# EAGLE design MotorController (EAGLE 6.1)
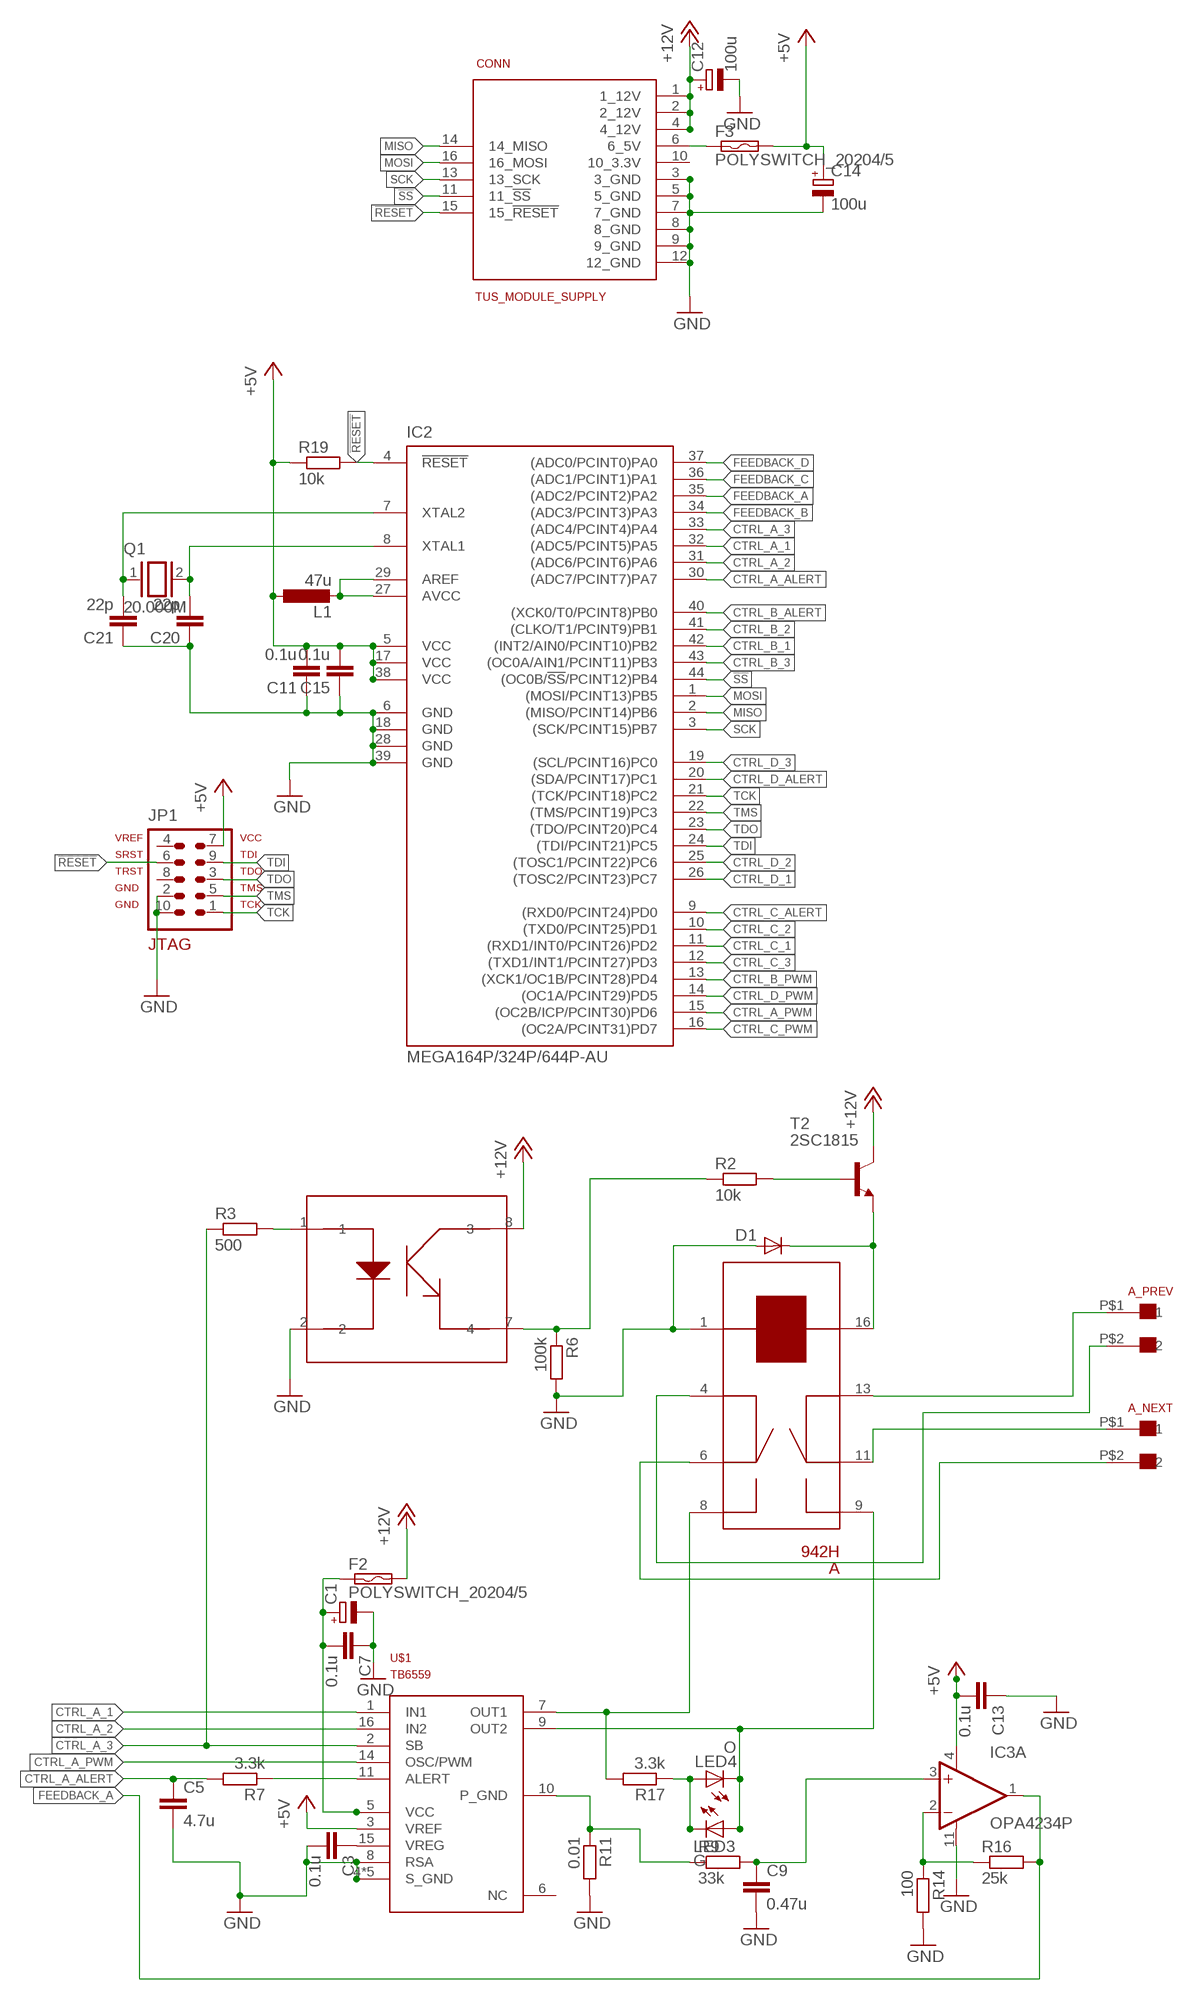
[diagram p0: schematic, sheet 1, part 1 of 2]
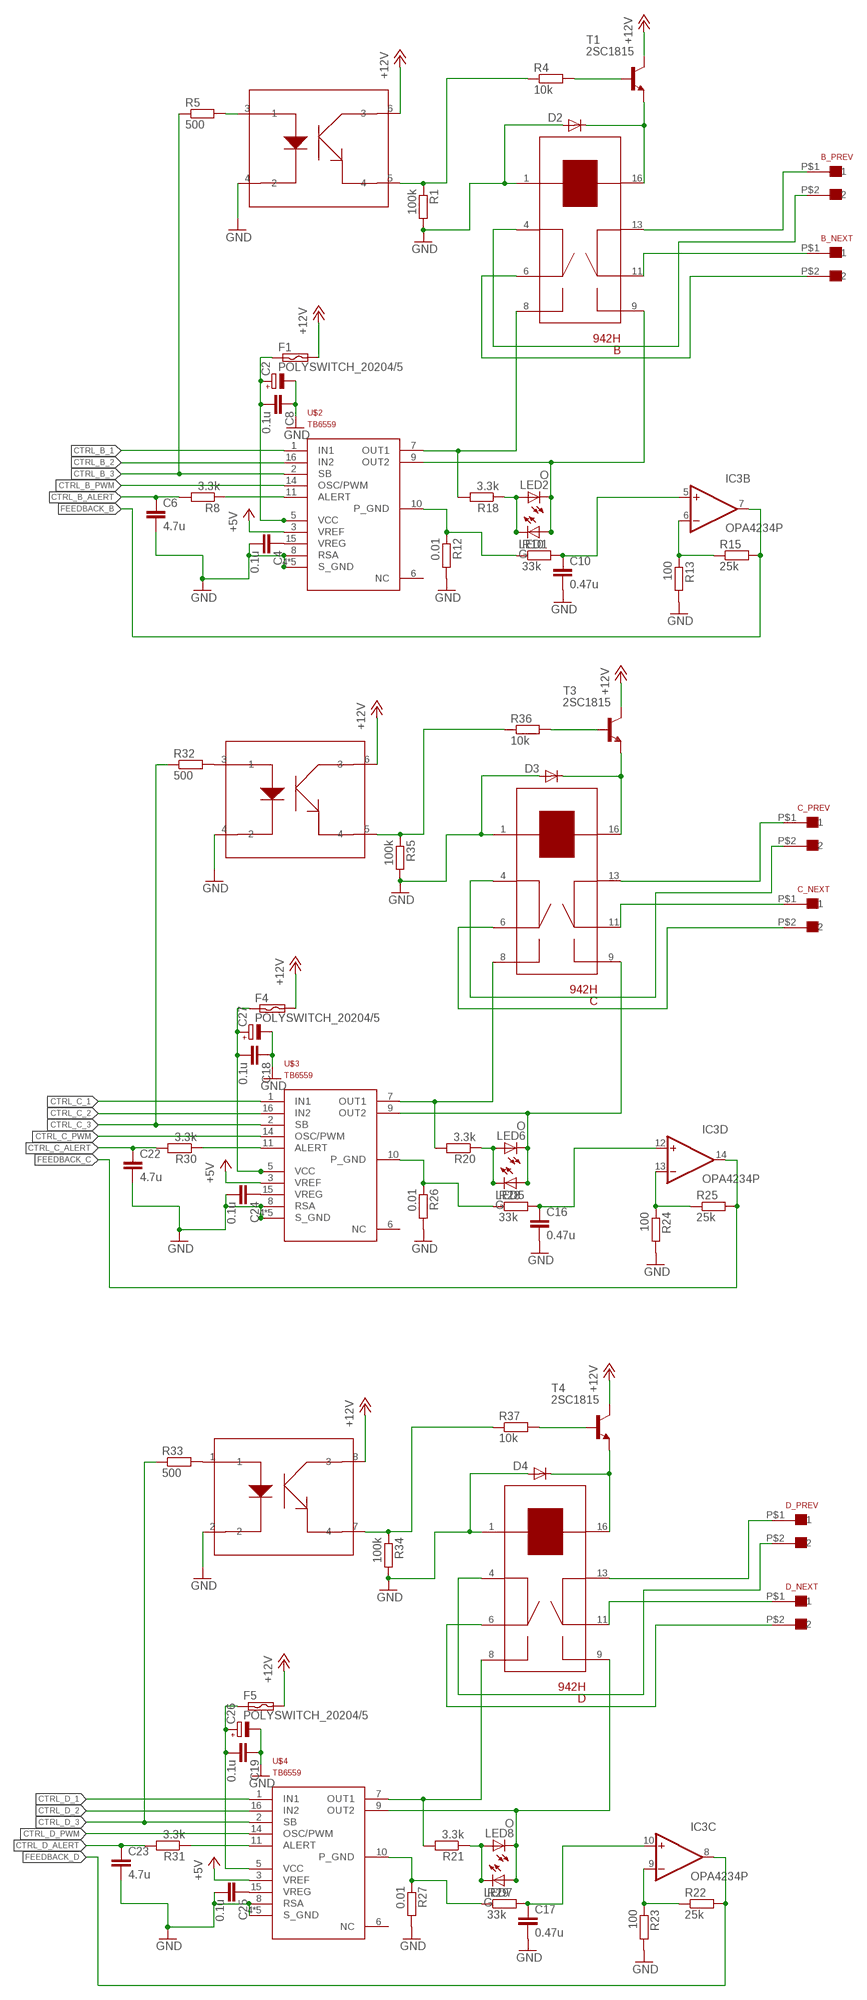
[diagram p1: schematic, sheet 1, part 2 of 2]

## Parts
A  942H  [941H-2C-12D]
A_NEXT  XH-2  [XH-2]
A_PREV  XH-2  [XH-2]
B  942H  [941H-2C-12D]
B_NEXT  XH-2  [XH-2]
B_PREV  XH-2  [XH-2]
C  942H  [941H-2C-12D]
C1  CPOL-EUE2,5-6E  [E2,5-6E]
C2  CPOL-EUE2,5-6E  [E2,5-6E]
C3  0.1u  C-EUC0603  [C0603]
C4  0.1u  C-EUC0603  [C0603]
C5  4.7u  C-EUC0603  [C0603]
C6  4.7u  C-EUC0603  [C0603]
C7  0.1u  C-EUC0603  [C0603]
C8  0.1u  C-EUC0603  [C0603]
C9  0.47u  C-EUC0603  [C0603]
C10  0.47u  C-EUC0603  [C0603]
C11  0.1u  C-EUC0603  [C0603]
C12  100u  CPOL-EUE2.5-6  [E2,5-6]
C13  0.1u  C-EUC0603  [C0603]
C14  100u  CPOL-EUE2-5  [E2-5]
C15  0.1u  C-EUC0603  [C0603]
C16  0.47u  C-EUC0603  [C0603]
C17  0.47u  C-EUC0603  [C0603]
C18  0.1u  C-EUC0603  [C0603]
C19  0.1u  C-EUC0603  [C0603]
C20  22p  C-EUC0603  [C0603]
C21  22p  C-EUC0603  [C0603]
C22  4.7u  C-EUC0603  [C0603]
C23  4.7u  C-EUC0603  [C0603]
C24  0.1u  C-EUC0603  [C0603]
C25  0.1u  C-EUC0603  [C0603]
C26  CPOL-EUE2,5-6E  [E2,5-6E]
C27  CPOL-EUE2,5-6E  [E2,5-6E]
C_NEXT  XH-2  [XH-2]
C_PREV  XH-2  [XH-2]
CONN  TUS_MODULE_SUPPLY  [2X08]
D  942H  [941H-2C-12D]
D1  1N4148DO35-7  [DO35-7]
D2  1N4148DO35-7  [DO35-7]
D3  1N4148DO35-7  [DO35-7]
D4  1N4148DO35-7  [DO35-7]
D_NEXT  XH-2  [XH-2]
D_PREV  XH-2  [XH-2]
F1  POLYSWITCH_20204/5  [0204/5]
F2  POLYSWITCH_20204/5  [0204/5]
F3  POLYSWITCH_20204/5  [0204/5]
F4  POLYSWITCH_20204/5  [0204/5]
F5  POLYSWITCH_20204/5  [0204/5]
IC1  TLP621-2  [SOCKET-08]
IC2  MEGA164P/324P/644P-AU  [TQFP44]
IC3  OPA4234P  [DIL14]
IC4  TLP621-2  [SOCKET-08]
JP1  AVR-JTAG-10  [AVR-JTAG-10]
L1  47u  L-EUL3216C  [L3216C]
LED1  G  LED3MM  [LED3MM]
LED2  O  LED3MM  [LED3MM]
LED3  G  LED3MM  [LED3MM]
LED4  O  LED3MM  [LED3MM]
LED5  G  LED3MM  [LED3MM]
LED6  O  LED3MM  [LED3MM]
LED7  G  LED3MM  [LED3MM]
LED8  O  LED3MM  [LED3MM]
Q1  20.000M  XTAL/S  [QS]
R1  100k  R-EU_R0603  [R0603]
R2  10k  R-EU_R0603  [R0603]
R3  500  R-EU_R0603  [R0603]
R4  10k  R-EU_R0603  [R0603]
R5  500  R-EU_R0603  [R0603]
R6  100k  R-EU_R0603  [R0603]
R7  3.3k  R-EU_R0603  [R0603]
R8  3.3k  R-EU_R0603  [R0603]
R9  33k  R-EU_R0603  [R0603]
R10  33k  R-EU_R0603  [R0603]
R11  0.01  R-EU_R1206  [R1206]
R12  0.01  R-EU_R1206  [R1206]
R13  100  R-EU_R0603  [R0603]
R14  100  R-EU_R0603  [R0603]
R15  25k  R-EU_R0603  [R0603]
R16  25k  R-EU_R0603  [R0603]
R17  3.3k  R-EU_R0603  [R0603]
R18  3.3k  R-EU_R0603  [R0603]
R19  10k  R-EU_R0603  [R0603]
R20  3.3k  R-EU_R0603  [R0603]
R21  3.3k  R-EU_R0603  [R0603]
R22  25k  R-EU_R0603  [R0603]
R23  100  R-EU_R0603  [R0603]
R24  100  R-EU_R0603  [R0603]
R25  25k  R-EU_R0603  [R0603]
R26  0.01  R-EU_R1206  [R1206]
R27  0.01  R-EU_R1206  [R1206]
R28  33k  R-EU_R0603  [R0603]
R29  33k  R-EU_R0603  [R0603]
R30  3.3k  R-EU_R0603  [R0603]
R31  3.3k  R-EU_R0603  [R0603]
R32  500  R-EU_R0603  [R0603]
R33  500  R-EU_R0603  [R0603]
R34  100k  R-EU_R0603  [R0603]
R35  100k  R-EU_R0603  [R0603]
R36  10k  R-EU_R0603  [R0603]
R37  10k  R-EU_R0603  [R0603]
T1  2SC1815  [TO92-ECB]
T2  2SC1815  [TO92-ECB]
T3  2SC1815  [TO92-ECB]
T4  2SC1815  [TO92-ECB]
U$1  TB6559  [HSOP-16]
U$2  TB6559  [HSOP-16]
U$3  TB6559  [HSOP-16]
U$4  TB6559  [HSOP-16]

## Nets
!RESET: CONN.15(15_!RESET) IC2.4(!RESET) JP1.6 R19.2
!SS: CONN.11(11_!SS) IC2.44((OC0B/!SS!/PCINT12)PB4)
+5V [5v]: C11.2 C13.2 C14.+ C15.2 F3.2 IC2.5(VCC) IC2.17(VCC) IC2.38(VCC) IC3.4(A:V+) JP1.7 L1.1 R19.1 U$1.3(VREF) U$2.3(VREF) U$3.3(VREF) U$4.3(VREF)
+12V [12v]: C12.+ CONN.1(1_12V) CONN.2(2_12V) CONN.4(4_12V) F1.2 F2.2 F4.2 F5.2 IC1.6 IC1.8 IC4.6 IC4.8 T1.C T2.C T3.C T4.C
A_OUT1 [12v_sup]: A.8 R17.2 U$1.7(OUT1)
A_OUT2 [12v_sup]: A.9('1) LED3.A LED4.K(C) U$1.9(OUT2)
A_OUT3 [12v_sup]: C.8 R20.2 U$3.7(OUT1)
A_OUT4 [12v_sup]: C.9('1) LED5.A LED6.K(C) U$3.9(OUT2)
A_OUT5 [12v_sup]: B.8 R18.2 U$2.7(OUT1)
A_OUT6 [12v_sup]: B.9('1) LED1.A LED2.K(C) U$2.9(OUT2)
A_OUT7 [12v_sup]: D.8 R21.2 U$4.7(OUT1)
A_OUT8 [12v_sup]: D.9('1) LED7.A LED8.K(C) U$4.9(OUT2)
CTRL_A_1: IC2.32((ADC5/PCINT5)PA5) U$1.1(IN1)
CTRL_A_2: IC2.31((ADC6/PCINT6)PA6) U$1.16(IN2)
CTRL_A_3: IC2.33((ADC4/PCINT4)PA4) R3.1 U$1.2(SB)
CTRL_A_ALERT: C5.1 IC2.30((ADC7/PCINT7)PA7) R7.2
CTRL_A_PWM: IC2.15((OC2B/ICP/PCINT30)PD6) U$1.14(OSC/PWM)
CTRL_B_1: IC2.42((INT2/AIN0/PCINT10)PB2) U$2.1(IN1)
CTRL_B_2: IC2.41((CLKO/T1/PCINT9)PB1) U$2.16(IN2)
CTRL_B_3: IC2.43((OC0A/AIN1/PCINT11)PB3) R5.1 U$2.2(SB)
CTRL_B_ALERT: C6.1 IC2.40((XCK0/T0/PCINT8)PB0) R8.2
CTRL_B_PWM: IC2.13((XCK1/OC1B/PCINT28)PD4) U$2.14(OSC/PWM)
CTRL_C_1: IC2.11((RXD1/INT0/PCINT26)PD2) U$3.1(IN1)
CTRL_C_2: IC2.10((TXD0/PCINT25)PD1) U$3.16(IN2)
CTRL_C_3: IC2.12((TXD1/INT1/PCINT27)PD3) R32.1 U$3.2(SB)
CTRL_C_ALERT: C22.1 IC2.9((RXD0/PCINT24)PD0) R30.2
CTRL_C_PWM: IC2.16((OC2A/PCINT31)PD7) U$3.14(OSC/PWM)
CTRL_D_1: IC2.26((TOSC2/PCINT23)PC7) U$4.1(IN1)
CTRL_D_2: IC2.25((TOSC1/PCINT22)PC6) U$4.16(IN2)
CTRL_D_3: IC2.19((SCL/PCINT16)PC0) R33.1 U$4.2(SB)
CTRL_D_ALERT: C23.1 IC2.20((SDA/PCINT17)PC1) R31.2
CTRL_D_PWM: IC2.14((OC1A/PCINT29)PD5) U$4.14(OSC/PWM)
D [12v_sup]: D.4 D_PREV.P$2
FEEDBACK_A: IC2.35((ADC2/PCINT2)PA2) IC3.1(A:OUT) R16.2
FEEDBACK_B: IC2.34((ADC3/PCINT3)PA3) IC3.7(B:OUT) R15.2
FEEDBACK_C: IC2.36((ADC1/PCINT1)PA1) IC3.14(D:OUT) R25.2
FEEDBACK_D: IC2.37((ADC0/PCINT0)PA0) IC3.8(C:OUT) R22.2
GND: A.1 B.1 C1.- C2.- C3.2 C4.2 C5.2 C6.2 C7.1 C8.1 C9.2 C10.2 C11.1 C12.- C13.1 C14.- C15.1 C16.2 C17.2 C18.1 C19.1 C20.1 C21.1 C22.2 C23.2 C24.2 C25.2 C26.- C27.- C.1 CONN.3(3_GND) CONN.5(5_GND) CONN.7(7_GND) CONN.8(8_GND) CONN.9(9_GND) CONN.12(12_GND) D1.A D2.A D3.A D4.A D.1 IC1.2 IC1.4 IC2.6(GND) IC2.18(GND) IC2.28(GND) IC2.39(GND) IC3.11(A:V-) IC4.2 IC4.4 JP1.2 JP1.10 R1.2 R6.2 R11.2 R12.2 R13.2 R14.2 R23.2 R24.2 R26.2 R27.2 R34.2 R35.2 U$1.4(S_GND) U$1.8(RSA) U$1.12(S_GND) U$1.13(S_GND) U$1.FIN_1(S_GND) U$1.FIN_2(S_GND) U$2.4(S_GND) U$2.8(RSA) U$2.12(S_GND) U$2.13(S_GND) U$2.FIN_1(S_GND) U$2.FIN_2(S_GND) U$3.4(S_GND) U$3.8(RSA) U$3.12(S_GND) U$3.13(S_GND) U$3.FIN_1(S_GND) U$3.FIN_2(S_GND) U$4.4(S_GND) U$4.8(RSA) U$4.12(S_GND) U$4.13(S_GND) U$4.FIN_1(S_GND) U$4.FIN_2(S_GND)
MISO: CONN.14(14_MISO) IC2.2((MISO/PCINT14)PB6)
MOSI: CONN.16(16_MOSI) IC2.1((MOSI/PCINT13)PB5)
N$1: IC2.27(AVCC) IC2.29(AREF) L1.2
N$2: C21.2 IC2.7(XTAL2) Q1.1
N$3: C20.2 IC2.8(XTAL1) Q1.2
N$4: R7.1 U$1.11(ALERT)
N$5: C3.1 U$1.15(VREG)
N$6: IC1.1 R3.2
N$7: IC1.7 R2.1 R6.1
N$8: LED3.K(C) LED4.A R17.1
N$9: C24.1 U$3.15(VREG)
N$10 [12v_sup]: C1.+ C7.2 F2.1 U$1.5(VCC)
N$11: IC3.2(A:-IN) R14.1 R16.1
N$12: R30.1 U$3.11(ALERT)
N$13 [12v_sup]: A.6 A_NEXT.P$2
N$14: R9.1 R11.1 U$1.10(P_GND)
N$15 [12v_sup]: A.11('2) A_NEXT.P$1
N$16 [12v_sup]: A.4 A_PREV.P$2
N$17 [12v_sup]: A.13('3) A_PREV.P$1
N$18 [12v_sup]: C18.2 C27.+ F4.1 U$3.5(VCC)
N$19: LED5.K(C) LED6.A R20.1
N$20: IC1.3 R5.2
N$21: C9.1 IC3.3(A:+IN) R9.2
N$22 [12v_sup]: C.6 C_NEXT.P$2
N$23 [12v_sup]: C.11('2) C_NEXT.P$1
N$24 [12v_sup]: C.4 C_PREV.P$2
N$25 [12v_sup]: C.13('3) C_PREV.P$1
N$26: IC4.5 R35.1 R36.1
N$27 [12v]: C.16('4) D3.C T3.E
N$28: R36.2 T3.B
N$29: IC3.13(D:-IN) R24.1 R25.1
N$30: C16.1 IC3.12(D:+IN) R28.2
N$31: R26.1 R28.1 U$3.10(P_GND)
N$32: C4.1 U$2.15(VREG)
N$33: R8.1 U$2.11(ALERT)
N$34 [12v_sup]: C2.+ C8.2 F1.1 U$2.5(VCC)
N$35: LED1.K(C) LED2.A R18.1
N$36: IC4.1 R33.2
N$37 [12v_sup]: B.6 B_NEXT.P$2
N$38 [12v_sup]: B.11('2) B_NEXT.P$1
N$39 [12v_sup]: B.4 B_PREV.P$2
N$40 [12v_sup]: B.13('3) B_PREV.P$1
N$41: IC1.5 R1.1 R4.1
N$42 [12v]: B.16('4) D2.C T1.E
N$43: R4.2 T1.B
N$44: IC3.6(B:-IN) R13.1 R15.1
N$45: C10.1 IC3.5(B:+IN) R10.2
N$46: R10.1 R12.1 U$2.10(P_GND)
N$47: C25.1 U$4.15(VREG)
N$48: R31.1 U$4.11(ALERT)
N$49 [12v_sup]: C19.2 C26.+ F5.1 U$4.5(VCC)
N$50: LED7.K(C) LED8.A R21.1
N$51: IC4.3 R32.2
N$52 [12v_sup]: D.6 D_NEXT.P$2
N$53 [12v_sup]: D.11('2) D_NEXT.P$1
N$54: CONN.6(6_5V) F3.1
N$55 [12v_sup]: D.13('3) D_PREV.P$1
N$56: IC4.7 R34.1 R37.1
N$57 [12v]: D4.C D.16('4) T4.E
N$58: R37.2 T4.B
N$59: IC3.9(C:-IN) R22.1 R23.1
N$60: C17.1 IC3.10(C:+IN) R29.2
N$61: R27.1 R29.1 U$4.10(P_GND)
N$84 [12v]: A.16('4) D1.C T2.E
N$86: R2.2 T2.B
SCK: CONN.13(13_SCK) IC2.3((SCK/PCINT15)PB7)
TCK: IC2.21((TCK/PCINT18)PC2) JP1.1
TDI: IC2.24((TDI/PCINT21)PC5) JP1.9
TDO: IC2.23((TDO/PCINT20)PC4) JP1.3
TMS: IC2.22((TMS/PCINT19)PC3) JP1.5
Unconnected: CONN.10(10_3.3V) JP1.4 JP1.8 U$1.6(NC) U$2.6(NC) U$3.6(NC) U$4.6(NC)

## Library data of the parts
A B C D = myparts:942H
A_NEXT A_PREV B_NEXT B_PREV C_NEXT C_PREV D_NEXT D_PREV = myparts:XH-2
C1 C2 C12 C14 C26 C27 = rcl:CPOL-EU: POLARIZED CAPACITOR, European symbol
C3-C11 C13 C15-C25 = rcl:C-EU: CAPACITOR, European symbol
CONN = tus:TUS_MODULE_SUPPLY
D1-D4 = diode:1N4148: DIODE high speed (Philips)
F1-F5 = myparts:POLYSWITCH_2
IC1 IC4 = myparts:TLP621-2
IC2 = avr-7:MEGA164P/324P/644P-AU
IC3 = burr-brown:OPA4234: Low Power, Precision Single-Supply Operational Amplifiers; OC_FARNELL: unknown; OC_NEWARK: unknown
JP1 = avr-7:AVR-JTAG-10: AVR JTAG Debug/Programming Header
L1 = rcl:L-EU: INDUCTOR, European symbol
LED1-LED8 = led:LED: LED OSRAM: - CHIPLED LG R971, LG N971, LY N971, LG Q971, LY Q971, LO R971, LY R971 LH N974, LH R974 LS Q976, LO Q976, LY Q976 LO Q996 - Hyper CHIPLED LW Q18S LB Q993, LB Q99A, LB R99A - SideLED LS A670, LO A670, LY A670, LG A670, LP A670 LB A673, LV A673, LT A673, LW A673 LH A674 LY A675 LS A676, LA A676, LO A676, LY A676, LW A676 LS A679, LY A679, LG A679 - Hyper Micro SIDELED® LS Y876, LA Y876, LO Y876, LY Y876 LT Y87S - SmartLED LW L88C, LW L88S LB L89C, LB L89S, LG L890 LS L89K, LO L89K, LY L89K LS L896, LA L896, LO L896, LY L896 - TOPLED LS T670, LO T670, LY T670, LG T670, LP T670 LSG T670, LSP T670, LSY T670, LOP T670, LYG T670 LG T671, LOG T671, LSG T671 LB T673, LV T673, LT T673, LW T673 LH T674 LS T676, LA T676, LO T676, LY T676, LB T676, LH T676, LSB T676, LW T676 LB T67C, LV T67C, LT T67C, LS T67K, LO T67K, LY T67K, LW E67C LS E67B, LA E67B, LO E67B, LY E67B, LB E67C, LV E67C, LT E67C LW T67C LS T679, LY T679, LG T679 LS T770, LO T770, LY T770, LG T770, LP T770 LB T773, LV T773, LT T773, LW T773 LH T774 LS E675, LA E675, LY E675, LS T675 LS T776, LA T776, LO T776, LY T776, LB T776 LHGB T686 LT T68C, LB T68C - Hyper Mini TOPLED® LB M676 - Mini TOPLED Santana® LG M470 LS M47K, LO M47K, LY M47K Source: http://www.osram.convergy.de LUXEON: - LUMILED® LXK2-PW12-R00, LXK2-PW12-S00, LXK2-PW14-U00, LXK2-PW14-V00 LXK2-PM12-R00, LXK2-PM12-S00, LXK2-PM14-U00 LXK2-PE12-Q00, LXK2-PE12-R00, LXK2-PE12-S00, LXK2-PE14-T00, LXK2-PE14-U00 LXK2-PB12-K00, LXK2-PB12-L00, LXK2-PB12-M00, LXK2-PB14-N00, LXK2-PB14-P00, LXK2-PB14-Q00 LXK2-PR12-L00, LXK2-PR12-M00, LXK2-PR14-Q00, LXK2-PR14-R00 LXK2-PD12-Q00, LXK2-PD12-R00, LXK2-PD12-S00 LXK2-PH12-R00, LXK2-PH12-S00 LXK2-PL12-P00, LXK2-PL12-Q00, LXK2-PL12-R00 Source: www.luxeon.com KINGBRIGHT: KA-3528ASYC Source: www.kingbright.com
Q1 = special:XTAL/S: CRYSTAL
R1-R37 = resistor:R-EU_: RESISTOR, European symbol
T1-T4 = myparts:2SC1815: NPN EPITAXIAL TRANSISTOR Source: TOSHIBA .. 2SC1815 1.pdf
U$1-U$4 = myparts:TB6559

## Net classes
1 12v: width 1.27 mm
2 5v: width 0.508 mm
3 12v_sup: width 0.508 mm

## Board
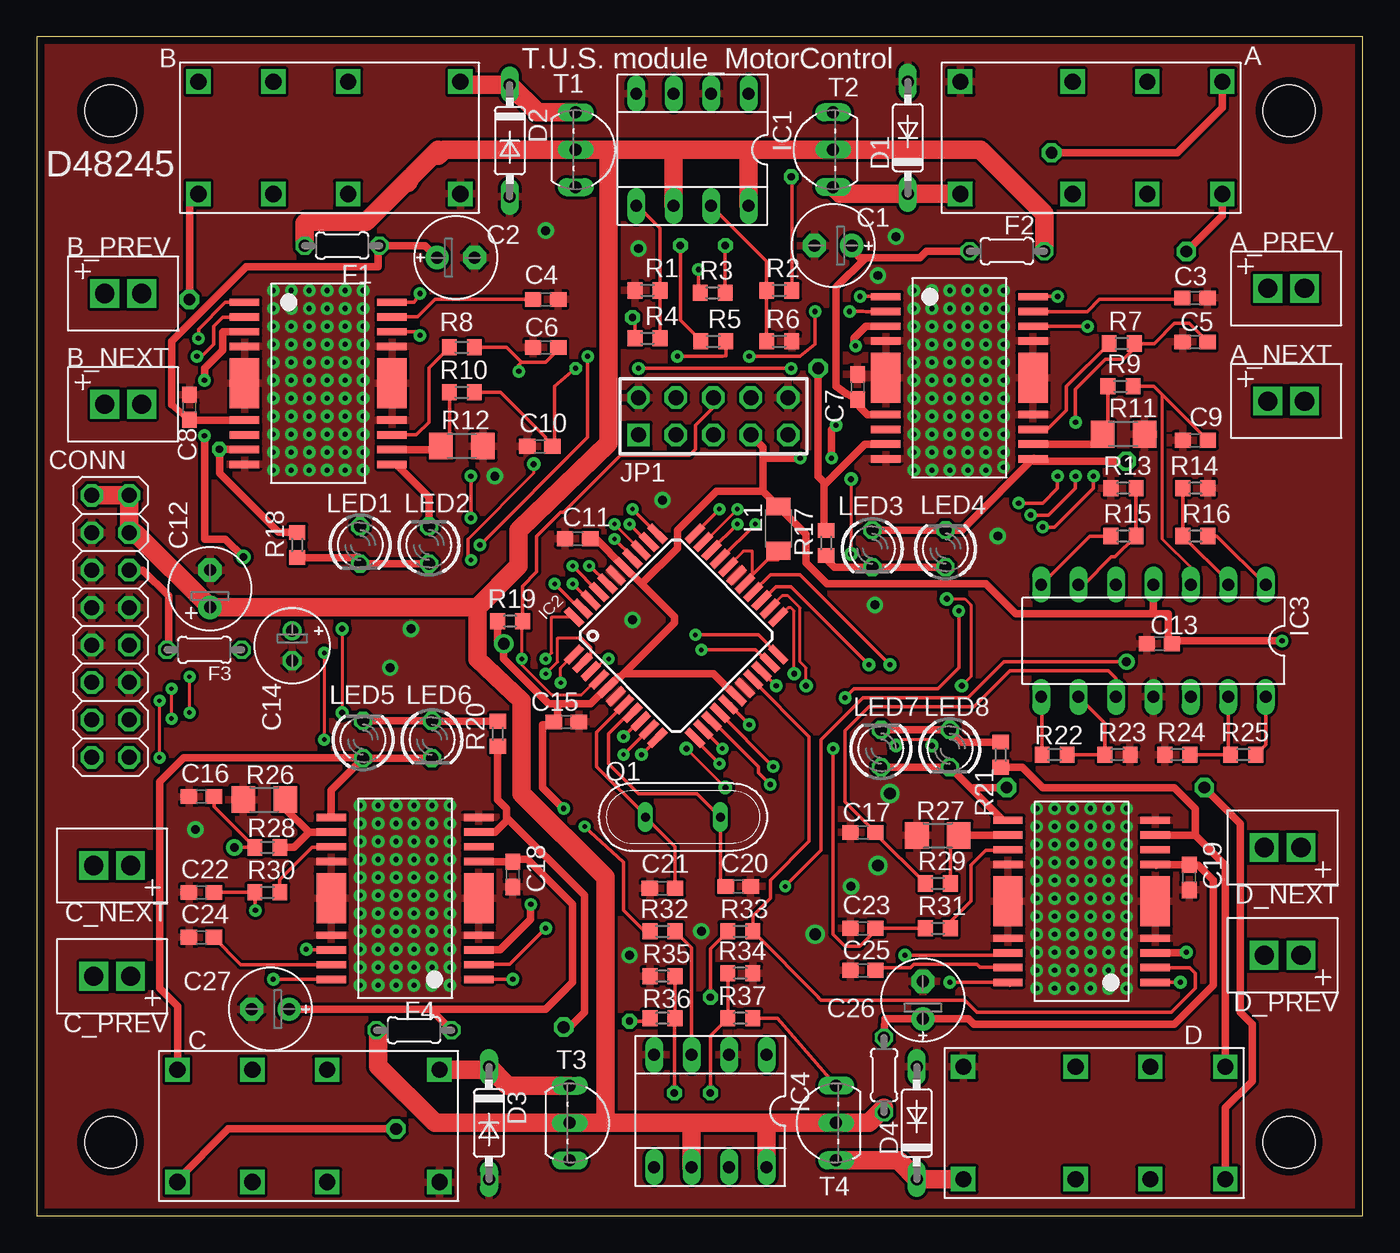
[diagram p2: board, top side]
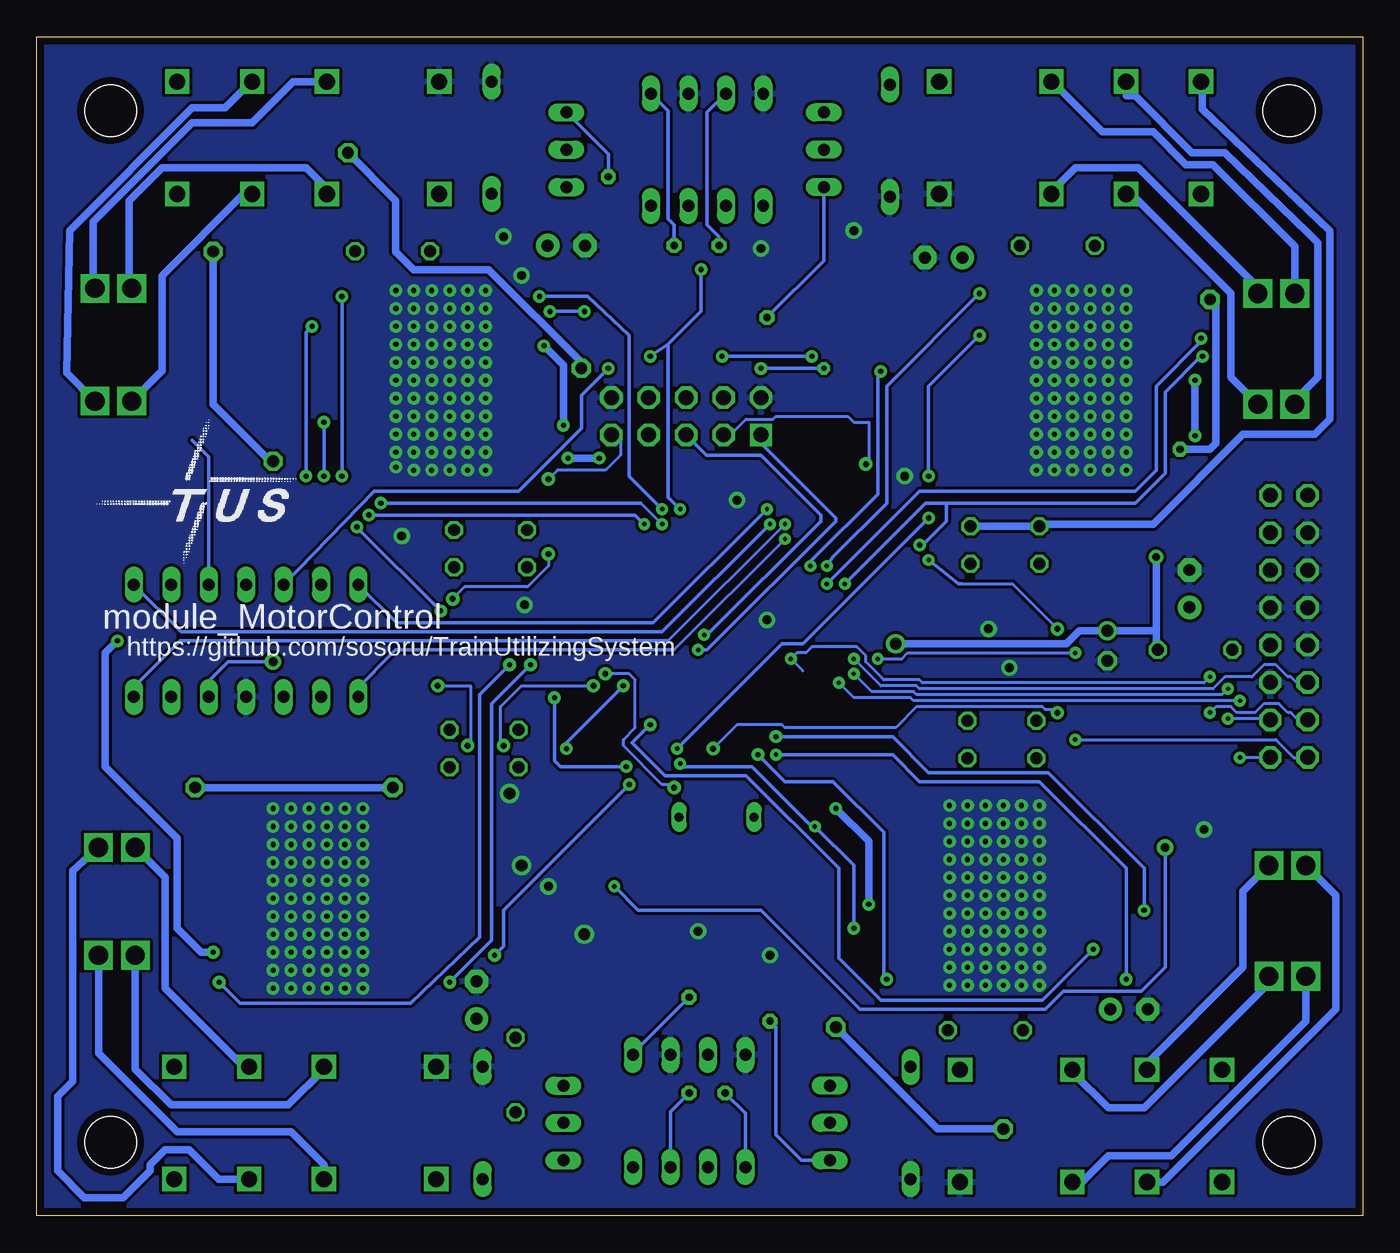
[diagram p3: board, bottom side, seen from below]

Size 90 x 80 mm. Coordinates in mm from the lower left corner, seen from the top.
Outline: 0,0 90,0 90,80 0,80 0,0
Copper layers (1*16): Top 0.035mm / dielectric 1.5mm / Bottom 0.035mm
Design rules: minimum track width 8mil, minimum drill 0.3mm, track to track 8mil, track to pad 8mil, pad to pad 8mil, via to via 8mil, smd to smd 8mil, copper to edge 20mil, drill to drill 8mil, minimum pad ring 8mil, minimum via ring 10mil, stop-mask expansion 3mil, vias tented up to drill 0mil, thermal gap 8mil
Holes 3.5 mm at 5,75 5,5 85,5 85,75
vRestrict: area 13,50.2 to 25.4,63.8; area 57.1,50.6 to 69.5,64.2; area 57.1,15.4 to 69.5,29.1; area 13,15.2 to 25.4,28.9

### Footprints (pad centres in the part's own frame; a part is rotated, then mirrored left to right if it is on the bottom)
941H-2C-12D = drill 1.1 square: 1 -7.62,3.81; 4 0,3.81; 6 5.08,3.81; 8 10.16,3.81; 9 10.16,-3.81; 11 5.08,-3.81; 13 0,-3.81; 16 -7.62,-3.81
XH-2 = drill 1.3 square: P$1 -2.5,0; P$2 0,0
E2,5-6E = drill 0.813 pad 1.575: + -1.27,0 | drill 0.813 pad 1.575 octagon: - 1.27,0
C0603 = smd 1.1 x 1: 1 -0.85,0; 2 0.85,0
E2,5-6 = drill 0.813 pad 1.6: + -1.27,0 | drill 0.813 pad 1.6 octagon: - 1.27,0
E2-5 = drill 0.813 pad 1.27: + -1.016,0 | drill 0.813 pad 1.27 octagon: - 1.016,0
2X08 = drill 1.016 octagon: 1 -8.89,-1.27; 2 -8.89,1.27; 3 -6.35,-1.27; 4 -6.35,1.27; 5 -3.81,-1.27; 6 -3.81,1.27; 7 -1.27,-1.27; 8 -1.27,1.27; 9 1.27,-1.27; 10 1.27,1.27; 11 3.81,-1.27; 12 3.81,1.27; 13 6.35,-1.27; 14 6.35,1.27; 15 8.89,-1.27; 16 8.89,1.27
DO35-7 = drill 0.813 long: A 3.81,0; C -3.81,0
0204/5 = drill 0.813 octagon: 1 -2.54,0; 2 2.54,0
SOCKET-08 = drill 0.813 long: 1 -3.81,-3.81; 2 -1.27,-3.81; 3 1.27,-3.81; 4 3.81,-3.81; 5 3.81,3.81; 6 1.27,3.81; 7 -1.27,3.81; 8 -3.81,3.81
TQFP44 = smd 1.5 x 0.5: 1 -5.8,4; 2 -5.8,3.2; 3 -5.8,2.4; 4 -5.8,1.6; 5 -5.8,0.8; 6 -5.8,0; 7 -5.8,-0.8; 8 -5.8,-1.6; 9 -5.8,-2.4; 10 -5.8,-3.2; 11 -5.8,-4; 23 5.8,-4; 24 5.8,-3.2; 25 5.8,-2.4; 26 5.8,-1.6; 27 5.8,-0.8; 28 5.8,0; 29 5.8,0.8; 30 5.8,1.6; 31 5.8,2.4; 32 5.8,3.2; 33 5.8,4 | smd 0.5 x 1.5: 12 -4,-5.8; 13 -3.2,-5.8; 14 -2.4,-5.8; 15 -1.6,-5.8; 16 -0.8,-5.8; 17 0,-5.8; 18 0.8,-5.8; 19 1.6,-5.8; 20 2.4,-5.8; 21 3.2,-5.8; 22 4,-5.8; 34 4,5.8; 35 3.2,5.8; 36 2.4,5.8; 37 1.6,5.8; 38 0.8,5.8; 39 0,5.8; 40 -0.8,5.8; 41 -1.6,5.8; 42 -2.4,5.8; 43 -3.2,5.8; 44 -4,5.8
DIL14 = drill 0.813 long: 1 -7.62,-3.81; 2 -5.08,-3.81; 3 -2.54,-3.81; 4 0,-3.81; 5 2.54,-3.81; 6 5.08,-3.81; 7 7.62,-3.81; 8 7.62,3.81; 9 5.08,3.81; 10 2.54,3.81; 11 0,3.81; 12 -2.54,3.81; 13 -5.08,3.81; 14 -7.62,3.81
AVR-JTAG-10 = drill 1.016 square: 1 -5.08,-1.27 | drill 1.016 octagon: 2 -5.08,1.27; 3 -2.54,-1.27; 4 -2.54,1.27; 5 0,-1.27; 6 0,1.27; 7 2.54,-1.27; 8 2.54,1.27; 9 5.08,-1.27; 10 5.08,1.27
L3216C = smd 1.2 x 1.6: 1 -1.5,0; 2 1.5,0
LED3MM = drill 0.813 octagon: A -1.27,0; K 1.27,0
QS = drill 0.61 long: 1 -2.54,0; 2 2.54,0
R0603 = smd 1 x 1.1: 1 -0.85,0; 2 0.85,0
R1206 = smd 1.6 x 1.803: 1 -1.422,0; 2 1.422,0
TO92-ECB = drill 0.813 long: B 2.54,0; C 0,0; E -2.54,0
HSOP-16 = smd 0.5 x 2: 1 -5.5,-5; 2 -4.5,-5; 3 -3.5,-5; 4 -2.5,-5; 5 2.5,-5; 6 3.5,-5; 7 4.5,-5; 8 5.5,-5; 9 5.5,5; 10 4.5,5; 11 3.5,5; 12 2.5,5; 13 -2.5,5; 14 -3.5,5; 15 -4.5,5; 16 -5.5,5 | smd 3.4 x 2: FIN_1 0,5; FIN_2 0,-5

### Placement (x,y rotation side)
A  70.31,73.15 0 top
A_NEXT  86.06,55.28 0 top
A_PREV  86.06,62.93 0 top
B  21.13,73.15 180 top
B_NEXT  7.11,55.07 0 top
B_PREV  7.11,62.59 0 top
C  19.71,6.1 180 top
C1  54.05,65.84 180 top
C2  28.45,65.02 0 top
C3  78.61,62.28 0 top
C4  34.54,62.18 0 top
C5  78.63,59.3 180 top
C6  34.54,58.93 180 top
C7  55.72,56.24 270 top
C8  10.36,54.86 270 top
C9  78.64,52.63 180 top
C10  34.14,52.22 180 top
C11  36.71,45.94 0 top
C12  11.76,42.55 90 top
C13  76.2,38.81 0 top
C14  17.34,38.68 270 top
C15  35.94,33.51 180 top
C16  11.18,28.45 180 top
C17  56.08,26.01 180 top
C18  32.31,23.16 90 top
C19  78.23,22.96 90 top
C20  47.61,22.35 180 top
C21  42.46,22.22 0 top
C22  11.18,21.95 180 top
C23  56.08,19.51 180 top
C24  11.18,18.9 180 top
C25  56.08,16.66 180 top
C26  60.15,14.63 90 top
C27  15.85,14.02 180 top
C_NEXT  3.86,23.77 180 top
C_PREV  3.86,16.26 180 top
CONN  5,40 270 top
D  70.51,6.3 0 top
D1  59.13,73.15 90 top
D2  32.11,72.95 270 top
D3  30.68,6.3 270 top
D4  59.74,6.3 90 top
D_NEXT  83.31,24.99 180 top
D_PREV  83.31,17.68 180 top
F1  20.73,65.84 180 top
F2  65.85,65.46 0 top
F3  11.38,38.4 0 top
F4  25.6,12.6 180 top
F5  57.51,9.55 270 top
IC1  44.5,72.34 180 top
IC2  43.4,39.36 45 top
IC3  75.79,39.01 180 top
IC4  45.72,7.11 180 top
JP1  45.92,54.25 0 top
L1  50.34,46.63 270 top
LED1  21.95,45.52 270 top
LED2  26.62,45.52 90 top
LED3  56.71,45.27 270 top
LED4  61.68,45.27 90 top
LED5  22.15,32.31 90 top
LED6  26.82,32.31 270 top
LED7  57.3,31.7 90 top
LED8  61.98,31.7 270 top
Q1  43.85,27.06 0 top
R1  41.45,62.79 180 top
R2  50.39,62.79 0 top
R3  45.88,62.63 0 top
R4  41.45,59.54 180 top
R5  45.92,59.33 180 top
R6  50.39,59.33 0 top
R7  73.64,59.19 0 top
R8  28.85,58.93 0 top
R9  73.56,56.29 0 top
R10  28.85,55.88 0 top
R11  73.76,53.04 0 top
R12  28.85,52.22 0 top
R13  73.76,49.38 180 top
R14  78.64,49.38 0 top
R15  73.76,46.13 180 top
R16  78.64,46.13 0 top
R17  53.58,45.66 90 top
R18  17.68,45.52 90 top
R19  32.12,40.35 0 top
R20  31.29,32.72 270 top
R21  65.43,31.29 270 top
R22  69.09,31.29 180 top
R23  73.36,31.29 0 top
R24  77.42,31.29 180 top
R25  81.89,31.29 0 top
R26  15.44,28.24 180 top
R27  61.16,25.81 180 top
R28  15.65,24.99 180 top
R29  61.16,22.56 180 top
R30  15.65,21.95 180 top
R31  61.16,19.51 180 top
R32  42.47,19.3 0 top
R33  47.75,19.3 180 top
R34  47.75,16.46 0 top
R35  42.47,16.26 180 top
R36  42.47,13.41 180 top
R37  47.75,13.41 0 top
T1  36.58,72.34 270 top
T2  54.05,72.34 90 top
T3  36.17,6.3 270 top
T4  54.25,6.3 90 top
U$1  62.63,56.86 270 top
U$2  19.1,56.49 270 top
U$3  24.99,21.54 90 top
U$4  70.92,21.34 90 top

### Tracks (layer width: path | path; a pad name or v marks a point on that pad's centre or on a via)
!RESET  (via drill 0.3)
  Top 0.203: IC2.4 38,36.37 36.98,35.36 34.95,35.36 32.92,37.39 v32.92,37.8 32.92,40.23 R19.2 | v19.51,38.2 v19.51,32.31
  Top 0.254: JP1.6 45.92,54.86 44.7,53.65 44.7,52.02 44.3,51.61 39.62,51.61 35.76,47.75 35.56,47.75 33.93,46.13 33.93,43.69 32.97,42.73 R19.2
  Bottom 0.203: v19.51,32.31 5.89,32.31 4.67,31.09 3.86,31.09 CONN.15 | v19.51,38.2 30.89,38.2 31.29,37.8 v32.92,37.8
!SS  (via drill 0.3)
  Top 0.203: v34.54,37.8 34.95,38.2 34.95,40.64 36.37,40.64 IC2.44
  Bottom 0.203: v34.54,37.8 32.72,35.97 30.28,35.97 30.07,35.76 10.16,35.76 9.35,36.58 7.52,36.58 6.71,37.39 5.89,37.39 5.08,36.58 4.88,36.58 4.47,36.17 3.86,36.17 CONN.11
+5V  (via drill 0.35, 0.5, 0.8)
  Top 0.508: 35.36,34.75 35.36,33.78 C15.2 35.15,33.53 35.15,33.33 34.34,33.33 34.34,29.06 v35.76,27.64 | IC2.5 38.67,35.82 37.59,34.75 35.36,34.75 | IC2.5 38.73,35.88 | U$2.3 12.64,59.99 12.6,59.94 12.6,58.73 11.38,57.51 v11.38,56.69 | v11.38,52.93 11.38,45.92 12.8,45.92 v14.02,44.7 | 49.3,49.17 46.13,49.17 43.48,46.53 43.48,45.31 41.05,42.88 | 49.3,49.17 L1.1 52.22,46.25 52.22,44.3 53.65,42.88 64.41,42.88 66.45,40.84 75.59,40.84 | 49.3,49.17 49.3,51.61 | 49.3,51.61 49.3,52.15 JP1.7 | v51.82,51.41 49.5,51.41 49.3,51.61 | 75.59,40.84 76.81,40.84 76.81,38.81 C13.2 76.85,39.01 v84.53,39.01 | U$4.3 77.98,17.84 v78.03,17.88 | U$3.3 31.45,18.04 33.53,20.12 v33.53,21.13 | 41.05,42.88 39.9,44.02 IC2.38 37.95,45.94 C11.2 | 39.93,36.88 43.28,40.23 43.28,40.64 41.05,42.88 | 39.93,36.88 39.62,36.58 39.48,36.58 IC2.5 | IC2.17 47.45,35.26 45.92,36.78 40.03,36.78 39.93,36.88 | v53.95,51.41 53.95,53.34 v54.25,53.65 | IC3.4 75.79,41.05 75.59,40.84 | v55.58,59.03 55.47,59.13 55.47,59.54 56.3,60.36 56.7,60.36 56.9,60.35 57.51,60.35 U$1.3 | 35.36,34.75 34.75,34.75 31.7,37.8 v31.7,38.81 31.5,38.81 31.29,39.01 31.29,40.23 R19.1
  Bottom 0.508: v11.38,56.69 v11.38,52.93 | 54.46,53.65 v54.25,53.65 54.25,57.71 v55.58,59.03 | v53.95,51.41 v51.82,51.41 | v78.03,17.88 78.84,17.88 80.47,19.51 80.47,25.6 85.34,30.48 85.34,38.2 v84.53,39.01 | v33.53,21.13 33.53,25.4 v35.76,27.64 | v14.02,44.7 14.02,39.62 | 14.02,39.62 14.02,38.61 | 14.02,38.48 13.89,38.48 13.82,38.41 | 14.02,38.48 14.02,38.41 F3.2 14.02,38.61 | 14.02,38.61 14.02,38.48 | 14.02,39.62 14.09,39.7 C14.+ 19.23,39.7 20.12,38.81 v31.7,38.81
+12V
  Top 1.27: T2.C 64.06,72.34 68.39,68 F2.2 | T2.C 53.85,72.34 | CONN.1 CONN.2 CONN.4 6.68,46.35 11.68,41.35 | 29.9,41.28 C12.+ 11.79,41.45 11.68,41.35 | 29.9,41.28 32.72,44.09 32.72,46.53 38.81,52.43 38.81,72.34 | 38.81,72.34 T1.C 27.64,72.34 27.23,71.93 27.03,72.14 | 38.81,72.34 43.48,72.34 | 43.48,72.34 48.36,72.34 | 48.36,72.34 T2.C | IC1.6 43.23,72.08 43.48,72.34 | IC1.8 48.31,72.29 48.36,72.34 | 38.61,6.3 T3.C 27.03,6.3 23.16,10.16 23.16,12.5 F4.2 | 38.61,6.3 44.3,6.3 | 44.3,6.3 49.58,6.3 | 49.58,6.3 T4.C 56.49,6.3 57.51,7.32 F5.2 | IC4.6 44.45,6.15 44.3,6.3 | IC4.8 49.53,6.25 49.58,6.3 | 29.9,41.28 29.9,37.76 32.92,34.95 32.92,28.65 38.61,22.96 38.61,6.3 | 27.03,72.14 25.5,70.61 25.2,70.1 25.09,70.21 | 27.03,72.14 27.23,72.34 | 11.68,41.35 11.79,41.25 | F1.2 18.19,67.36 18.29,67.46 22.35,67.46 25.09,70.21 | 25.09,70.21 25.4,70.51
A_OUT1  (via drill 0.8)
  Top 0.508: U$1.7 56.22,52.36 53.44,49.58 | 53.44,49.58 53.44,46.53 53.65,46.53 R17.2 | A.8 80.47,75.18 77.42,72.14 v68.89,72.14 | v53.03,57.51 53.03,50.19 53.44,49.78 53.44,49.58
  Bottom 0.508: v53.03,57.51 53.03,57.91 59.33,64.21 64.41,64.21 65.63,65.43 65.63,68.89 v68.89,72.14
A_OUT2  (via drill 0.8)
  Top 0.508: LED3.A LED4.K 61.77,46.53 62.79,46.53 63.2,46.94 63.21,46.94 U$1.9 67.67,51.41 67.67,51.21 v73.97,51.21 | A.9 80.47,67.87 v78.03,65.43
  Bottom 0.508: v78.03,65.43 78.03,55.07 74.17,51.21 v73.97,51.21
A_OUT3  (via drill 0.8)
  Top 0.508: U$3.7 31.12,26.04 31.9,26.82 31.9,27.03 | 31.9,27.03 31.9,27.64 31.29,28.25 31.29,31.7 | 31.29,31.7 31.5,31.9 | C.8 9.55,2.44 13.01,5.89 v24.38,5.89 | v35.76,12.8 36.17,12.8 37.19,13.82 37.19,21.74 31.9,27.03 | 31.29,31.9 R20.2 31.29,31.7
  Bottom 0.508: v24.38,5.89 28.85,5.89 v35.76,12.8
A_OUT4
  Top 0.508: LED6.K LED5.A | C.9 9.55,14.22 8.33,15.44 8.33,29.46 9.96,31.09 22.15,31.09 LED5.A | U$3.9 19.99,28.88 LED5.A
A_OUT5  (via drill 0.5, 0.8)
  Top 0.508: U$2.7 14.07,52.02 v12.39,52.02 12.39,50.39 16.42,46.37 R18.2 | v10.36,62.18 10.36,68.73 B.8
  Bottom 0.508: v12.39,52.02 10.36,52.02 9.96,52.43 9.96,61.77 v10.36,62.18
A_OUT6
  Top 0.508: U$2.9 24.4,50.99 26.62,48.77 LED2.K
  Bottom 0.508: 10.87,77.11 10.97,77.22 | 20.15,46.91 20.52,46.91 | 20.52,46.91 21.95,46.91 | 21.95,46.91 LED1.A LED2.K | 21.95,46.94 21.95,46.91 | 20.52,46.91 20.52,46.94 14.22,46.94 8.13,53.03 3.25,53.03 2.23,54.05 2.23,66.85 10.87,75.08 10.87,77.11 | 10.87,77.11 10.97,77.01 B.9
A_OUT7
  Top 0.508: D.8 80.67,23.77 78.64,25.81 | 78.64,25.81 76,25.81 | 76,25.81 75.79,25.81 | R21.2 66.89,30.44 68.28,29.06 77.22,29.06 78.64,27.64 78.64,25.81 | 76,25.81 U$4.7
A_OUT8  (via drill 0.8)
  Top 0.508: LED7.A LED8.K 63.48,28.93 | U$4.9 65.57,26.84 63.48,28.93 | D.9 80.67,7.32 82.5,9.14 82.5,13.01 81.69,13.82 81.69,26.62 v79.25,29.06 | v65.84,29.06 63.6,29.06 63.48,28.93
  Bottom 0.508: v79.25,29.06 v65.84,29.06
CTRL_A_1  (via drill 0.3, 0.35)
  Top 0.203: 45.31,45.72 v47.55,47.95 | 57.71,62.38 U$1.1
  Top 0.254: IC2.32 45.31,45.72 | 57.6,62.38 U$1.1 | v55.88,62.38 57.71,62.38
  Bottom 0.254: v47.55,47.95 49.78,50.19 49.78,59.74 52.63,62.38 v55.88,62.38
CTRL_A_2  (via drill 0.3, 0.35)
  Top 0.203: 67.67,62.38 U$1.16
  Top 0.254: IC2.31 45.8,45.19 v47.55,46.94 | v66.65,48.36 68.28,48.36 69.29,49.38 v69.29,50.19 | v69.29,62.38 67.67,62.38
  Bottom 0.203: v47.55,46.94 48.97,48.36
  Bottom 0.254: 48.97,48.36 v66.65,48.36 | v69.29,50.19 v69.29,62.38
CTRL_A_3  (via drill 0.3, 0.35)
  Top 0.203: 44.91,62.38 R3.1
  Top 0.254: IC2.33 v46.33,47.95 | v44.91,64.21 44.91,62.38 44.91,62.18 | U$1.2 56.28,61.36 56.08,61.37 v55.17,61.37 | v52.83,61.37 52.83,59.13 51.82,58.32 v48.36,58.32
  Bottom 0.254: v46.33,47.95 47.14,48.77 47.14,59.13 | 47.14,59.13 44.91,61.37 v44.91,64.21 | v55.17,61.37 v52.83,61.37 | v48.36,58.32 47.14,59.13
CTRL_A_ALERT  (via drill 0.3, 0.35)
  Top 0.203: 74.57,58.93 74.57,59.13 R7.2
  Top 0.254: R7.2 75.85,59.19 77.22,60.55 78.22,60.55 C5.1 | IC2.30 46.42,44.59 v48.77,46.94 | v67.46,47.55 68.68,47.55 70.51,49.38 v70.51,50.19 | v70.51,53.85 70.51,56.08 72.54,58.12 73.76,58.12 74.57,58.93
  Bottom 0.254: v48.77,46.94 49.38,47.55 v67.46,47.55 | v70.51,50.19 v70.51,53.85
CTRL_A_PWM  (via drill 0.35)
  Top 0.254: IC2.15 46.37,34.1 v49.99,30.48 | U$1.14 v71.31,60.36 v71.32,60.35 | v68.28,46.74 69.09,46.74 71.73,49.38 v71.73,50.19 | v54.86,35.15 55.47,35.76 61.16,35.76 62.59,37.19 v62.59,41.05
  Bottom 0.254: v71.32,60.35 71.73,59.94 v71.73,50.19 71.73,49.99 | v68.28,46.74 v62.59,41.05 | v54.86,35.15 54.86,30.89 54.46,30.48 v49.99,30.48
CTRL_B_1  (via drill 0.3, 0.35)
  Top 0.203: 37.39,41.86 37.59,41.86 IC2.42
  Top 0.254: IC2.42 37.6,41.85 | v10.97,59.54 10.97,60.15 12.8,61.98 14.09,61.98 U$2.1 | v36.37,42.88 37.39,41.86
  Bottom 0.254: v36.37,42.88 30.07,49.17 15.44,49.17 14.02,50.6 14.02,56.29 10.97,59.33 v10.97,59.54
CTRL_B_2  (via drill 0.3, 0.35)
  Top 0.203: 24.18,61.98 U$2.16
  Top 0.254: IC2.41 38.14,42.33 v36.37,44.09 | 23.98,61.98 24.18,61.98 25.6,61.98 v26.01,62.59
  Bottom 0.254: v36.37,44.09 35.97,44.7 32.31,48.36 32.31,56.29 v26.01,62.59
CTRL_B_3  (via drill 0.3, 0.35)
  Top 0.254: IC2.43 36.83,41.2 v35.15,42.88 | U$2.2 14.07,60.96 12.6,60.96 11.99,60.35 11.99,59.13 11.18,58.32 v10.87,58.32 | R5.1 46.77,58.36 46.53,58.32 v43.48,58.32 | v37.39,58.32 37.39,52.83 v30.07,45.52
  Bottom 0.254: v35.15,42.88 29.67,48.36 28.25,48.36 | 28.25,48.36 15.44,48.36 13.41,50.39 13.41,55.88 10.97,58.32 v10.87,58.32 | v43.48,58.32 v37.39,58.32 | v30.07,45.52 29.87,45.52 28.25,47.14 28.25,48.36
CTRL_B_ALERT  (via drill 0.3, 0.35)
  Top 0.203: 35.36,58.73 35.36,58.93 C6.1
  Top 0.254: R8.2 31.9,58.93 32.92,57.91 | 32.92,57.91 34.54,57.91 35.36,58.73 | IC2.40 38.73,42.96 v37.49,44.09 | v32.72,57.3 32.72,57.71 32.92,57.91
  Bottom 0.254: v37.49,44.09 37.39,44.5 32.92,48.97 32.92,57.1 v32.72,57.3
CTRL_B_PWM  (via drill 0.3, 0.35)
  Top 0.254: IC2.13 v46.53,31.7 | v29.46,47.35 v29.46,50.19 | U$2.14 25.76,59.99 v26.01,59.74
  Bottom 0.254: v46.53,31.7 39.42,38.81 38,38.81 v29.46,47.35 | v29.46,50.19 29.46,56.29 v26.01,59.74
CTRL_C_1  (via drill 0.35)
  Top 0.254: IC2.11 42.12,32.37 v41.05,31.29 | v32.31,16.05 30.01,16.05 U$3.1
  Bottom 0.254: v41.05,31.29 39.22,29.46 35.97,29.46 32.51,26.01 32.51,16.26 v32.31,16.05
CTRL_C_2  (via drill 0.3, 0.35)
  Top 0.254: IC2.10 41.53,32.99 v39.83,31.29 | v16.05,16.05 19.98,16.05 U$3.16
  Bottom 0.254: v39.83,31.29 31.9,31.29 30.07,29.46 21.95,29.46 16.05,23.57 v16.05,16.05
CTRL_C_3  (via drill 0.3, 0.35)
  Top 0.254: IC2.12 44.67,32.34 v46.33,30.68 | v34.54,19.51 32.11,17.07 30.02,17.07 U$3.2 | R32.1 41.25,19.3 39.83,20.73 39.83,23.98 v37.19,26.42
  Bottom 0.254: v34.54,19.51 34.54,23.77 v37.19,26.42 37.39,26.42 41.45,30.48 46.13,30.48 v46.33,30.68
CTRL_C_ALERT  (via drill 0.35)
  Top 0.203: 14.63,21.95 R30.2
  Top 0.254: C22.1 14.63,21.95 14.83,21.74 | IC2.9 40.87,33.56 v39.83,32.51 | v14.83,20.73 14.83,21.91 R30.2
  Bottom 0.254: v39.83,32.51 31.9,32.51 29.46,30.07 21.34,30.07 14.83,23.57 v14.83,20.73
CTRL_C_PWM  (via drill 0.35)
  Top 0.203: 47.14,34.54 47.14,34.75 46.94,34.75 IC2.16
  Top 0.254: U$3.14 18.54,18.04 v18.29,18.09 | v48.36,33.33 47.14,34.54
  Bottom 0.254: v48.36,33.33 49.58,32.11 47.35,29.87 41.86,29.87 35.56,23.57 35.56,17.48 32.72,14.63 21.74,14.63 v18.29,18.09
CTRL_D_1  (via drill 0.35)
  Top 0.254: IC2.26 49.78,43.48 51.82,43.48 v57.91,37.39 | v77.62,15.85 U$4.1
  Bottom 0.254: v57.91,37.39 59.94,35.36 59.94,18.9 64.62,14.43 76.2,14.43 v77.62,15.85
CTRL_D_2  (via drill 0.35)
  Top 0.203: 65.84,15.85 U$4.16
  Top 0.254: IC2.25 49.28,41.76 50.19,42.67 51.21,42.67 v56.49,37.39 | v61.98,15.85 65.84,15.85 66.04,15.65
  Bottom 0.254: v56.49,37.39 59.13,34.75 59.13,18.69 v61.98,15.85
CTRL_D_3
  Top 0.203: 48.56,36.37 IC2.19
  Top 0.254: U$4.2 78.26,16.84 78.64,16.46 78.64,15.44 77.01,13.82 63.8,13.82 62.99,14.63 53.24,14.63 53.07,14.8 53.07,14.83 R33.1 48.6,20.36 49.78,21.54 49.78,22.76 52.43,25.4 52.43,32.51 48.56,36.37
CTRL_D_ALERT  (via drill 0.35)
  Top 0.203: 49.17,36.98 IC2.20 | 56.9,19.51 56.9,19.3
  Top 0.254: R31.2 C23.1 56.9,19.51 56.9,19.91 | v54.05,31.7 54.05,19.1 54.86,18.29 55.88,18.29 56.9,19.3 | v50.19,35.97 49.17,36.98
  Bottom 0.254: v54.05,31.7 54.05,32.11 v50.19,35.97
CTRL_D_PWM  (via drill 0.35)
  Top 0.203: 66.04,17.68 U$4.14
  Top 0.254: IC2.14 45.89,33.56 48.97,30.48 48.97,30.07 v49.78,29.26 | v58.93,17.68 66.04,17.68
  Bottom 0.254: v49.78,29.26 58.32,20.73 58.32,18.29 v58.93,17.68
D
  Bottom 0.508: D_PREV.P$2 83.31,9.96 80.87,7.52 72.95,7.52 70.51,9.96 70.61,10.06 | 70.61,10.06 70.71,10.16 | D.4 70.51,10.16 70.61,10.06
FEEDBACK_A  (via drill 0.3)
  Top 0.254: R16.2 80.11,46.13 IC3.1 | IC2.35 41.45,45.72 v40.23,46.94
  Bottom 0.254: v40.23,46.94 47.55,39.62 80.21,39.62 IC3.1
FEEDBACK_B  (via drill 0.3)
  Top 0.254: R15.2 71.48,46.13 IC3.7 | IC2.34 42.11,46.29 v40.44,47.95
  Bottom 0.254: v40.44,47.95 48.16,40.23 65.58,40.23 IC3.7
FEEDBACK_C  (via drill 0.3)
  Top 0.203: IC2.36 v39.22,46.94
  Top 0.254: IC3.14 83.41,31.97 R25.2 | IC2.36
  Bottom 0.203: v39.22,46.94 47.14,39.01 | 83.52,35.15 IC3.14
  Bottom 0.254: 47.14,39.01 80.26,39.01 83.72,35.56 83.72,35.36 83.52,35.15
FEEDBACK_D  (via drill 0.3)
  Top 0.254: 40.35,44.59 IC2.37 40.43,44.71 v39.22,45.92 | R22.2 68.24,35.14 IC3.8
  Bottom 0.203: v39.22,45.92 46.74,38.41 | 68.28,35.15 IC3.8
  Bottom 0.254: 46.74,38.41 65.63,38.41 68.48,35.56 68.48,35.36 68.28,35.15
GND  (via drill 0.35, 0.6, 0.8)
  Top 0.203: 68.07,56.69 U$1.FIN_1 | R1.2 40.64,62.79 R1.2 | R1.2 40.84,62.38 40.6,62.38
  other vias: 57.91,28.65 57.1,23.77 52.83,19.1 55.27,22.35 45.11,19.3 40.23,17.68 40.84,65.63 34.54,66.85 42.47,48.56 56.9,41.45 31.09,50.19 65.23,46.13 17.27,62.79 18.49,62.79 19.71,62.79 20.93,62.79 22.15,62.79 16.05,62.79 17.27,61.57 18.49,61.57 19.71,61.57 20.93,61.57 22.15,61.57 16.05,61.57 17.27,60.35 18.49,60.35 19.71,60.35 20.93,60.35 22.15,60.35 16.05,60.35 17.27,59.13 18.49,59.13 19.71,59.13 20.93,59.13 22.15,59.13 16.05,59.13 17.27,57.91 18.49,57.91 19.71,57.91 20.93,57.91 22.15,57.91 16.05,57.91 17.27,56.69 18.49,56.69 19.71,56.69 20.93,56.69 22.15,56.69 16.05,56.69 17.27,55.47 18.49,55.47 19.71,55.47 20.93,55.47 22.15,55.47 16.05,55.47 17.27,54.25 18.49,54.25 19.71,54.25 20.93,54.25 22.15,54.25 16.05,54.25 17.27,53.04 18.49,53.04 19.71,53.04 20.93,53.04 22.15,53.04 16.05,53.04 17.27,51.82 18.49,51.82 19.71,51.82 20.93,51.82 22.15,51.82 16.05,51.82 17.27,50.6 18.49,50.6 19.71,50.6 20.93,50.6 22.15,50.6 16.05,50.6 60.76,62.79 61.98,62.79 63.2,62.79 64.41,62.79 65.63,62.79 59.54,62.79 60.76,61.57 61.98,61.57 63.2,61.57 64.41,61.57 65.63,61.57 59.54,61.57 60.76,60.35 61.98,60.35 63.2,60.35 64.41,60.35 65.63,60.35 59.54,60.35 60.76,59.13 61.98,59.13 63.2,59.13 64.41,59.13 65.63,59.13 59.54,59.13 60.76,57.91 61.98,57.91 63.2,57.91 64.41,57.91 65.63,57.91 59.54,57.91 60.76,56.69 61.98,56.69 63.2,56.69 64.41,56.69 65.63,56.69 59.54,56.69 60.76,55.47 61.98,55.47 63.2,55.47 64.41,55.47 65.63,55.47 59.54,55.47 60.76,54.25 61.98,54.25 63.2,54.25 64.41,54.25 65.63,54.25 59.54,54.25 60.76,53.04 61.98,53.04 63.2,53.04 64.41,53.04 65.63,53.04 59.54,53.04 60.76,51.82 61.98,51.82 63.2,51.82 64.41,51.82 65.63,51.82 59.54,51.82 60.76,50.6 61.98,50.6 63.2,50.6 64.41,50.6 65.63,50.8 59.54,50.6 23.16,27.84 24.38,27.84 25.6,27.84 26.82,27.84 28.04,27.84 21.95,27.84 23.16,26.62 24.38,26.62 25.6,26.62 26.82,26.62 28.04,26.62 21.95,26.62 23.16,25.4 24.38,25.4 25.6,25.4 26.82,25.4 28.04,25.4 21.95,25.4 23.16,24.18 24.38,24.18 25.6,24.18 26.82,24.18 28.04,24.18 21.95,24.18 23.16,22.96 24.38,22.96 25.6,22.96 26.82,22.96 28.04,22.96 21.95,22.96 23.16,21.74 24.38,21.74 25.6,21.74 26.82,21.74 28.04,21.74 21.95,21.74 23.16,20.52 24.38,20.52 25.6,20.52 26.82,20.52 28.04,20.52 21.95,20.52 23.16,19.3 24.38,19.3 25.6,19.3 26.82,19.3 28.04,19.3 21.95,19.3 23.16,18.08 24.38,18.08 25.6,18.08 26.82,18.08 28.04,18.08 21.95,18.08 23.16,16.87 24.38,16.87 25.6,16.87 26.82,16.87 28.04,16.87 21.95,16.87 23.16,15.65 24.38,15.65 25.6,15.65 26.82,15.65 28.04,15.65 21.95,15.65 69.09,27.64 70.31,27.64 71.53,27.64 72.75,27.64 73.96,27.64 67.87,27.64 69.09,26.42 70.31,26.42 71.53,26.42 72.75,26.42 73.96,26.42 67.87,26.42 69.09,25.2 70.31,25.2 71.53,25.2 72.75,25.2 73.96,25.2 67.87,25.2 69.09,23.98 70.31,23.98 71.53,23.98 72.75,23.98 73.96,23.98 67.87,23.98 69.09,22.76 70.31,22.76 71.53,22.76 72.75,22.76 73.96,22.76 67.87,22.76 69.09,21.54 70.31,21.54 71.53,21.54 72.75,21.54 73.96,21.54 67.87,21.54 69.09,20.32 70.31,20.32 71.53,20.32 72.75,20.32 73.96,20.32 67.87,20.32 69.09,19.1 70.31,19.1 71.53,19.1 72.75,19.1 73.96,19.1 67.87,19.1 69.09,17.88 70.31,17.88 71.53,17.88 72.75,17.88 73.96,17.88 67.87,17.88 69.09,16.66 70.31,16.66 71.53,16.66 72.75,16.66 73.96,16.66 67.87,16.66 69.09,15.44 70.31,15.44 71.53,15.44 72.75,15.44 73.96,15.44 67.87,15.44 10.77,26.21 58.32,66.45 40.44,40.44 23.98,37.19 25.4,39.83 57.1,63.8
  pour Bottom: -2.24,-1.22 92.46,-1.22 92.46,81.89 -2.24,81.89
  pour Top: -3.45,84.12 -3.45,-3.66 94.28,-3.66 94.28,84.12
MISO  (via drill 0.3)
  Top 0.203: v34.54,36.78 35.36,37.59 35.36,39.22 36.98,39.22 37.59,38.61 37.59,38 37.19,37.59 IC2.2 | v9.14,33.73 v9.14,35.76
  Bottom 0.203: v34.54,36.78 33.33,35.56 30.48,35.56 30.28,35.36 9.55,35.36 v9.14,35.76 | v9.14,33.73 6.3,33.73 CONN.14
MOSI  (via drill 0.3)
  Top 0.203: v35.56,36.17 35.56,37.19 36.37,38 IC2.1 | v8.33,31.09 v8.33,34.95
  Bottom 0.203: v35.56,36.17 34.54,35.15 30.68,35.15 30.48,34.95 v8.33,34.95 | v8.33,31.09 6.3,31.09 CONN.16
N$1
  Top 0.203: 48.56,43.48 48.56,45.11 47.95,45.11 46.94,44.09 IC2.29
  Top 0.254: IC2.27 48.06,42.98 48.56,43.48 49.58,44.5 50.32,44.5 L1.2
N$2
  Top 0.254: C21.2 43.31,25.06 Q1.1 41.31,27.16 38,30.48 38,32.83 IC2.7
N$3
  Top 0.254: C20.2 46.39,22.71 Q1.2 44.8,28.65 40.84,28.65 38.81,30.68 38.81,32.72 40.22,34.12 IC2.8
N$4
  Top 0.254: U$1.11 68.6,53.36 69.9,54.66 69.9,56.3 R7.1
N$5
  Top 0.203: 77.83,62.18 C3.1
  Top 0.254: U$1.15 71.32,61.36 72.14,62.18 77.83,62.18
N$6  (via drill 0.5)
  Top 0.254: R3.2 46.73,66.03 v46.74,65.84
  Bottom 0.254: v46.74,65.84 46.74,67.26 47.14,67.67 47.14,74.98 IC1.1
N$7
  Top 0.254: IC1.7 49.54,64.76 R2.1 R6.1
N$8
  Top 0.203: R17.1 53.44,44.91 53.44,44.7
  Top 0.508: LED4.A LED3.K 54.15,44 53.44,44.7
N$9
  Top 0.203: 11.99,18.9 C24.1
  Top 0.254: U$3.15 13.85,17.04 11.99,18.9
N$10
  Top 0.508: U$1.5 56.38,54.36 55.88,54.86 55.88,55.63 C7.2 54.95,55.79 54.25,56.29 54.25,62.99 56.29,65.02 | F2.1 60.38,65.46 59.94,65.02 56.29,65.02 | 56.29,65.02 55.88,65.02 55.17,65.73 | 55.17,65.73 55.07,65.84 | C1.+ 55.27,65.84 55.17,65.73
N$11
  Top 0.254: R14.1 R16.1 80.87,43.04 IC3.2
N$12
  Top 0.254: R30.1 16.5,22.8 18.69,24.99 19.95,24.99 U$3.11
N$13
  Bottom 0.508: A.6 75.44,76.96 77.22,75.18 79.45,75.18 87.78,66.85 87.99,57.21 A_NEXT.P$2
N$14
  Top 0.254: R9.1 72.71,53.4 R11.1
  Top 0.508: U$1.10 71.67,52.36 R11.1
N$15
  Bottom 0.508: A.11 75.95,69.34 81.48,63.8 81.48,57.36 A_NEXT.P$1
N$16
  Bottom 0.508: A.4 72.59,76.96 75.39,74.17 79.45,74.17 86.16,67.46 86.16,63.03 A_PREV.P$2
N$17
  Bottom 0.508: A.13 70.31,69.7 71.73,71.12 81.48,71.12 83.72,68.89 83.72,63.09 A_PREV.P$1
N$18
  Top 0.508: U$3.5 32.28,24.04 C18.2 32.48,24.18 33.33,24.18 36.37,21.13 36.37,15.85 34.54,14.02 26.72,14.02 | C27.+ 26.72,14.02 | 26.72,14.02 F4.1
N$19
  Top 0.508: LED5.K LED6.A | LED6.A 26.98,33.58 27.03,33.53 | R20.1 26.84,33.56 LED6.A
N$20  (via drill 0.5)
  Top 0.254: R5.2 45.07,59.37 43.69,60.76 v43.69,65.84
  Bottom 0.254: v43.69,65.84 43.69,66.45 44.5,67.26 44.5,74.88 IC1.3
N$21
  Top 0.203: 76.42,55.7 76.4,55.68 76.4,45.92 78.44,43.89 78.44,42.88 IC3.3
  Top 0.254: R9.2 75.83,56.29 76.42,55.7 C9.1
  Bottom 0.254: IC3.3 78.33,51.51 79.45,52.63
N$22
  Bottom 0.508: C.6 13.56,2.29 1.83,14.02 1.83,21.74 C_NEXT.P$2
N$23
  Bottom 0.508: C.11 14.63,10.36 8.13,16.87 8.13,22.01 C_NEXT.P$1
N$24
  Bottom 0.508: C.4 19.05,2.29 17.27,4.06 13.01,4.06 3.86,13.21 C_PREV.P$2
N$25
  Bottom 0.508: C.13 19.71,9.75 17.27,7.32 14.83,7.32 6.5,15.65 6.5,16.11 C_PREV.P$1
N$26  (via drill 0.5)
  Top 0.254: v43.28,8.33 43.28,13.37 R36.1 R35.1
  Bottom 0.254: IC4.5 41.91,6.96 v43.28,8.33
N$27
  Top 1.27: C.16 30.48,9.91 D3.C 31.95,8.84 T3.E
N$28  (via drill 0.5)
  Top 0.254: v40.23,13.21 41.42,13.21 R36.2
  Bottom 0.254: T3.B 38.1,3.76 39.83,5.49 39.83,12.8 v40.23,13.21
N$29
  Top 0.254: IC3.13 80.87,31.46 R25.1 R24.1
N$30  (via drill 0.3, 0.6)
  Top 0.254: C16.1 12.03,27.76 R28.2 v13.41,24.99 | 50.6,22.15 v50.8,22.35 53.24,24.79 53.24,32.31 56.08,35.15 63.2,35.15 65.63,37.59 v73.97,37.59
  Bottom 0.203: 78.44,35.36 IC3.12
  Bottom 0.254: v73.97,37.59 77.01,37.59 78.44,36.17 78.44,35.36 78.44,35.15 | v13.41,24.99 13.41,16.87 15.04,15.24 20.32,15.24 21.54,14.02 34.14,14.02 40.84,20.73 49.17,20.73 v50.8,22.35
N$31
  Top 0.508: R28.1 17.48,24.99 18.49,26.01 | 18.49,26.01 19.96,26.01 U$3.10 | R26.1 16.86,27.64 18.49,26.01
N$32
  Top 0.203: 33.53,62.18 C4.1
  Top 0.254: U$2.15 25.84,60.99 27.03,62.18 33.53,62.18
N$33
  Top 0.254: U$2.11 25.76,52.99 26.62,53.85 26.62,57.54 R8.1
N$34
  Top 0.508: U$2.5 10.3,53.99 | 10.3,53.99 10.16,53.85 | 10.3,53.99 10.36,54.05 C8.2 9.14,55.03 9.14,59.33 14.22,64.41 23.16,64.41 23.16,65.63 23.37,65.84 | 23.37,65.84 26.36,65.84 C2.+ | 23.37,65.84 F1.1
N$35
  Top 0.508: LED2.A LED1.K 21.53,44.67 R18.1
N$36  (via drill 0.5)
  Top 0.254: v45.72,14.83 45.72,18.12 R33.2
  Bottom 0.254: IC4.1 49.53,11.02 v45.72,14.83
N$37
  Bottom 0.508: B.6 15.7,69.34 8.94,62.59 8.94,56.9 B_NEXT.P$2
N$38
  Bottom 0.508: B_NEXT.P$1 4.61,55.33 3.05,56.9 3.05,66.04 3.66,66.65 9.35,72.14 11.58,72.14 15.44,76 16.05,76 B.11
N$39
  Bottom 0.508: B_PREV.P$2 7.11,62.99 15.24,71.12 19.51,71.12 21.13,69.49 B.4 21.13,69.09
N$40
  Bottom 0.508: 4.47,62.59 B_PREV.P$1 4.61,65.78 10.16,71.32 11.99,71.32 14.22,73.56 17.68,73.56 21.13,77.01 B.13
N$41
  Top 0.203: 40.84,68.48 IC1.5 | 42.27,59.54 R4.1
  Top 0.254: 40.64,68.68 40.84,68.48 42.3,67.02 R1.1 42.3,59.58 42.27,59.54
N$42
  Top 1.27: B.16 28.96,76.76 D2.C 33.98,74.88 T1.E
N$43  (via drill 0.5)
  Top 0.254: R4.2 40.6,60.79 v40.44,60.96
  Bottom 0.254: v40.44,60.96 36.58,64.82 T1.B
N$44
  Top 0.254: R13.1 R15.1 73.19,44.7 72.95,44.7 71.07,42.82 IC3.6
N$45  (via drill 0.35)
  Top 0.254: v36.58,57.51 35.15,56.29 35.15,52.46 C10.1 34.54,52.67 34.54,52.83 31.5,55.88 R10.2 | v40.84,57.51 v51.21,57.51
  Bottom 0.254: v51.21,57.51 53.03,55.68 53.03,53.44 57.3,49.17 67.11,49.17 IC3.5 | v36.58,57.51 v40.84,57.51
N$46
  Top 0.254: R10.1 28,52.79 R12.1
  Top 0.508: U$2.10 27.2,51.99 R12.1
N$47
  Top 0.203: 56.9,16.66 C25.1 | 65.43,16.87 65.84,16.87 U$4.15
  Top 0.254: 56.9,16.46 56.9,16.66 57.07,16.84 59.3,16.84 59.54,17.07 63.8,17.07 64.01,16.87 65.43,16.87
N$48
  Top 0.254: R31.1 62.01,19.95 63.4,21.34 63.4,23.77 64.41,24.79 65.87,24.79 U$4.11
N$49
  Top 0.508: 75.94,23.81 U$4.5 76,23.77 76.03,23.81 C19.2 78.27,23.77 78.84,23.77 79.86,22.76 79.86,15.65 77.22,13.01 63.6,13.01 63.25,13.36 C26.+ 57.56,13.36 F5.1
N$50
  Top 0.508: R21.1 62.8,32.14 LED8.A LED7.K
N$51
  Top 0.254: IC4.3 44.45,18.17 R32.2
N$52
  Bottom 0.508: D.6 75.95,10.11 81.28,15.44 81.28,22.96 D_NEXT.P$2
N$53
  Bottom 0.508: D.11 77.67,2.49 79.65,4.47 81.28,4.47 82.3,3.45 82.3,3.05 84.12,1.22 86.77,1.22 88.59,3.05 88.59,8.13 87.58,9.14 87.58,23.43 D_NEXT.P$1
N$54
  Top 0.203: 8.94,38.41 F3.1
  Top 0.508: CONN.6 7.19,43.81 8.94,42.06 8.94,38.41
N$55
  Bottom 0.508: D_PREV.P$1 85.81,11.03 80.47,5.69 72.75,5.69 70.51,3.45 D.13
N$56  (via drill 0.5)
  Top 0.254: v45.72,8.33 45.72,12.23 R37.1 R34.1
  Bottom 0.254: IC4.7 46.99,7.06 v45.72,8.33
N$57
  Top 1.27: T4.E 58.47,3.76 D4.C D.16
N$58
  Top 0.254: R37.2 50.29,13.41 T4.B
N$59
  Top 0.254: IC3.9 72.5,33.41 R23.1 R22.1
N$60
  Top 0.254: 60.31,22.63 R29.2 56.93,25.93 C17.1 54.86,28.08 54.86,32.92 56.49,34.54 63.6,34.54 66.04,36.98 72.75,36.98 73.25,36.47 IC3.10
N$61
  Top 0.203: R27.1
  Top 0.254: R29.1 62.01,25.23 R27.1
  Top 0.508: U$4.10 62.62,25.84 R27.1
N$84
  Top 1.27: T2.E 54.51,69.34 D1.C A.16
N$86  (via drill 0.5)
  Top 0.254: R2.2 51.24,70.47 v51.21,70.51
  Bottom 0.254: v51.21,70.51 51.21,72.03 T2.B
SCK  (via drill 0.3)
  Top 0.203: v38.81,37.8 38.61,37.8 37.8,36.98 IC2.3 | v10.36,34.14 v10.36,36.58
  Bottom 0.203: 38,36.98 v38.81,37.8 38.41,38.2 37.8,38.2 37.39,38.61 34.34,38.61 33.73,38 33.73,37.59 32.51,36.37 30.07,36.37 29.87,36.17 10.77,36.17 v10.36,36.58 | v10.36,34.14 9.96,34.54 8.94,34.54 8.53,34.14 7.32,34.14 6.71,34.75 5.69,34.75 5.08,34.14 4.88,34.14 4.47,33.73 3.86,33.73 CONN.13
TCK  (via drill 0.3)
  Top 0.254: IC2.21 49.65,37.52 48.77,38.41 v45.11,38.41
  Bottom 0.254: v45.11,38.41 44.5,38.41 35.76,47.14 35.76,47.35 40.64,52.22 40.64,52.78 JP1.1
TDI  (via drill 0.4)
  Top 0.203: v52.22,35.97 52.22,37.19 51.82,37.59 51.82,41.25 51,42.06 50.6,42.06 49.78,41.25 IC2.24 | v58.32,31.9 58.73,32.31 60.55,32.31 60.55,32.11 v60.76,31.9 | v62.79,35.97 63.4,36.58 63.4,41.45 62.99,41.86 v61.77,41.86 | v55.27,49.99 v55.27,44.91
  Bottom 0.203: v52.22,35.97 57.1,35.97 58.52,34.54 58.52,32.11 v58.32,31.9 | v60.76,31.9 60.55,32.11 60.55,35.97 v62.79,35.97 | v61.77,41.86 60.96,42.67 56.69,42.67 55.27,44.09 v55.27,44.91 | v55.27,49.99 54.66,50.6 51.41,50.6 50.39,51.61 50.39,53.03 51,53.03 JP1.9
TDO  (via drill 0.3, 0.4)
  Top 0.203: v51.41,36.78 51.41,41.05 51.21,41.25 51,41.25 50.39,40.64 IC2.23 | v44.09,31.7 v46.74,29.06 | v20.73,39.83 v20.73,34.14 | 29.26,45.92 33.73,50.39 v33.73,51
  Top 0.254: 29.26,45.92 29.26,44.7 v29.46,44.5
  Bottom 0.203: v51.41,36.78 49.78,36.78 49.38,36.37 49.38,33.12 50.19,32.31 50.19,31.9 47.55,29.26 46.94,29.26 v46.74,29.06 | v44.09,31.7 42.47,33.33 39.42,33.33 39.22,33.12 31.7,33.12 30.28,34.54 21.74,34.54 21.54,34.34 20.93,34.34 v20.73,34.14 | v20.73,39.83 23.77,42.88 27.23,42.88 | v33.73,51 33.53,51.21 33.53,53.85 34.54,53.85 34.95,54.25 39.83,54.25 40.03,54.05 41.86,54.05 42.88,53.03 43.28,53.03 JP1.3
  Bottom 0.254: 29.46,44.7 v29.46,44.5 27.43,42.88 27.23,42.88
TMS  (via drill 0.3)
  Top 0.254: IC2.22 50.31,38.08 48.97,39.42 v44.7,39.42
  Bottom 0.254: v44.7,39.42 44.5,39.42 36.78,47.14 36.78,47.55 40.84,51.61 44.55,51.61 JP1.5

### Text on the board
tPlace: T.U.S. module_MotorControl
bPlace: module_MotorControl | https://github.com/sosoru/TrainUtilizingSystem
tNames: D48245